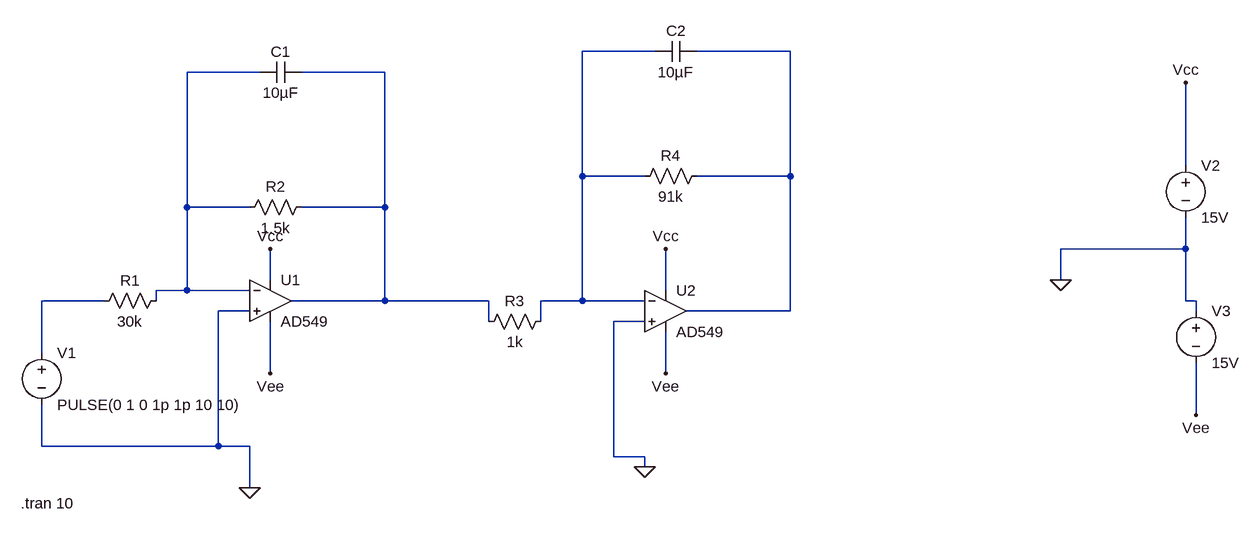
[diagram p0: schematic Roteiro_5.asc]
Roteiro_5.asc, the LTspice schematic file:
Version 4
SHEET 1 1816 680
WIRE 912 -496 800 -496
WIRE 1120 -496 976 -496
WIRE 304 -464 192 -464
WIRE 496 -464 368 -464
WIRE 1728 -320 1728 -448
WIRE 800 -304 800 -496
WIRE 896 -304 800 -304
WIRE 1120 -304 1120 -496
WIRE 1120 -304 976 -304
WIRE 192 -256 192 -464
WIRE 288 -256 192 -256
WIRE 496 -256 496 -464
WIRE 496 -256 368 -256
WIRE 1728 -192 1728 -240
WIRE 1728 -192 1536 -192
WIRE 320 -144 320 -192
WIRE 1536 -144 1536 -192
WIRE 192 -128 192 -256
WIRE 192 -128 144 -128
WIRE 288 -128 192 -128
WIRE 928 -128 928 -192
WIRE 64 -112 -32 -112
WIRE 144 -112 144 -128
WIRE 496 -112 496 -256
WIRE 496 -112 352 -112
WIRE 656 -112 496 -112
WIRE 800 -112 800 -304
WIRE 800 -112 736 -112
WIRE 896 -112 800 -112
WIRE 1728 -112 1728 -192
WIRE 1744 -112 1728 -112
WIRE 288 -96 240 -96
WIRE 1120 -96 1120 -304
WIRE 1120 -96 960 -96
WIRE 1744 -96 1744 -112
WIRE 656 -80 656 -112
WIRE 736 -80 736 -112
WIRE 896 -80 848 -80
WIRE -32 -32 -32 -112
WIRE 320 0 320 -80
WIRE 928 0 928 -64
WIRE 1744 64 1744 -16
WIRE -32 112 -32 48
WIRE 240 112 240 -96
WIRE 240 112 -32 112
WIRE 288 112 240 112
WIRE 848 128 848 -80
WIRE 896 128 848 128
WIRE 896 144 896 128
WIRE 288 176 288 112
FLAG 288 176 0
FLAG 896 144 0
FLAG 320 0 Vee
FLAG 320 -192 Vcc
FLAG 928 -192 Vcc
FLAG 928 0 Vee
FLAG 1536 -144 0
FLAG 1728 -448 Vcc
FLAG 1744 64 Vee
DATAFLAG 224 -128 ""
DATAFLAG 224 -128 ""
SYMBOL OpAmps\\AD549 320 -176 R0
SYMATTR InstName U1
SYMBOL OpAmps\\AD549 928 -160 R0
SYMATTR InstName U2
SYMBOL res 160 -128 R90
WINDOW 0 0 56 VBottom 2
WINDOW 3 32 56 VTop 2
SYMATTR InstName R1
SYMATTR Value 30k
SYMBOL res 384 -272 R90
WINDOW 0 0 56 VBottom 2
WINDOW 3 32 56 VTop 2
SYMATTR InstName R2
SYMATTR Value 1.5k
SYMBOL res 752 -96 R90
WINDOW 0 0 56 VBottom 2
WINDOW 3 32 56 VTop 2
SYMATTR InstName R3
SYMATTR Value 1k
SYMBOL res 992 -320 R90
WINDOW 0 0 56 VBottom 2
WINDOW 3 32 56 VTop 2
SYMATTR InstName R4
SYMATTR Value 91k
SYMBOL cap 368 -480 R90
WINDOW 0 0 32 VBottom 2
WINDOW 3 32 32 VTop 2
SYMATTR InstName C1
SYMATTR Value 10µF
SYMBOL cap 976 -512 R90
WINDOW 0 0 32 VBottom 2
WINDOW 3 32 32 VTop 2
SYMATTR InstName C2
SYMATTR Value 10µF
SYMBOL voltage -32 -48 R0
WINDOW 123 0 0 Left 0
WINDOW 39 0 0 Left 0
SYMATTR InstName V1
SYMATTR Value PULSE(0 1 0 1p 1p 10 10)
SYMBOL voltage 1728 -336 R0
WINDOW 123 0 0 Left 0
WINDOW 39 0 0 Left 0
SYMATTR InstName V2
SYMATTR Value 15V
SYMBOL voltage 1744 -112 R0
WINDOW 123 0 0 Left 0
WINDOW 39 0 0 Left 0
SYMATTR InstName V3
SYMATTR Value 15V
TEXT -64 200 Left 2 !.tran 10

The netlist it stands for:
* Roteiro_5.asc
XU1 0 N003 Vcc Vee N004 AD549  ; pins In+ In- V+ V- OUT
XU2 0 N001 Vcc Vee N002 AD549  ; pins In+ In- V+ V- OUT
R1 N003 N005 30k
R2 N004 N003 1.5k
R3 N001 N004 1k
R4 N002 N001 91k
C1 N004 N003 10µF
C2 N002 N001 10µF
V1 N005 0 PULSE(0 1 0 1p 1p 10 10)
V2 Vcc 0 15V
V3 0 Vee 15V
.tran 10
.backanno
.end